# EAGLE design Beehive_sensor_PCB_Rev_2.0_Fixed (EAGLE 9.6.2)
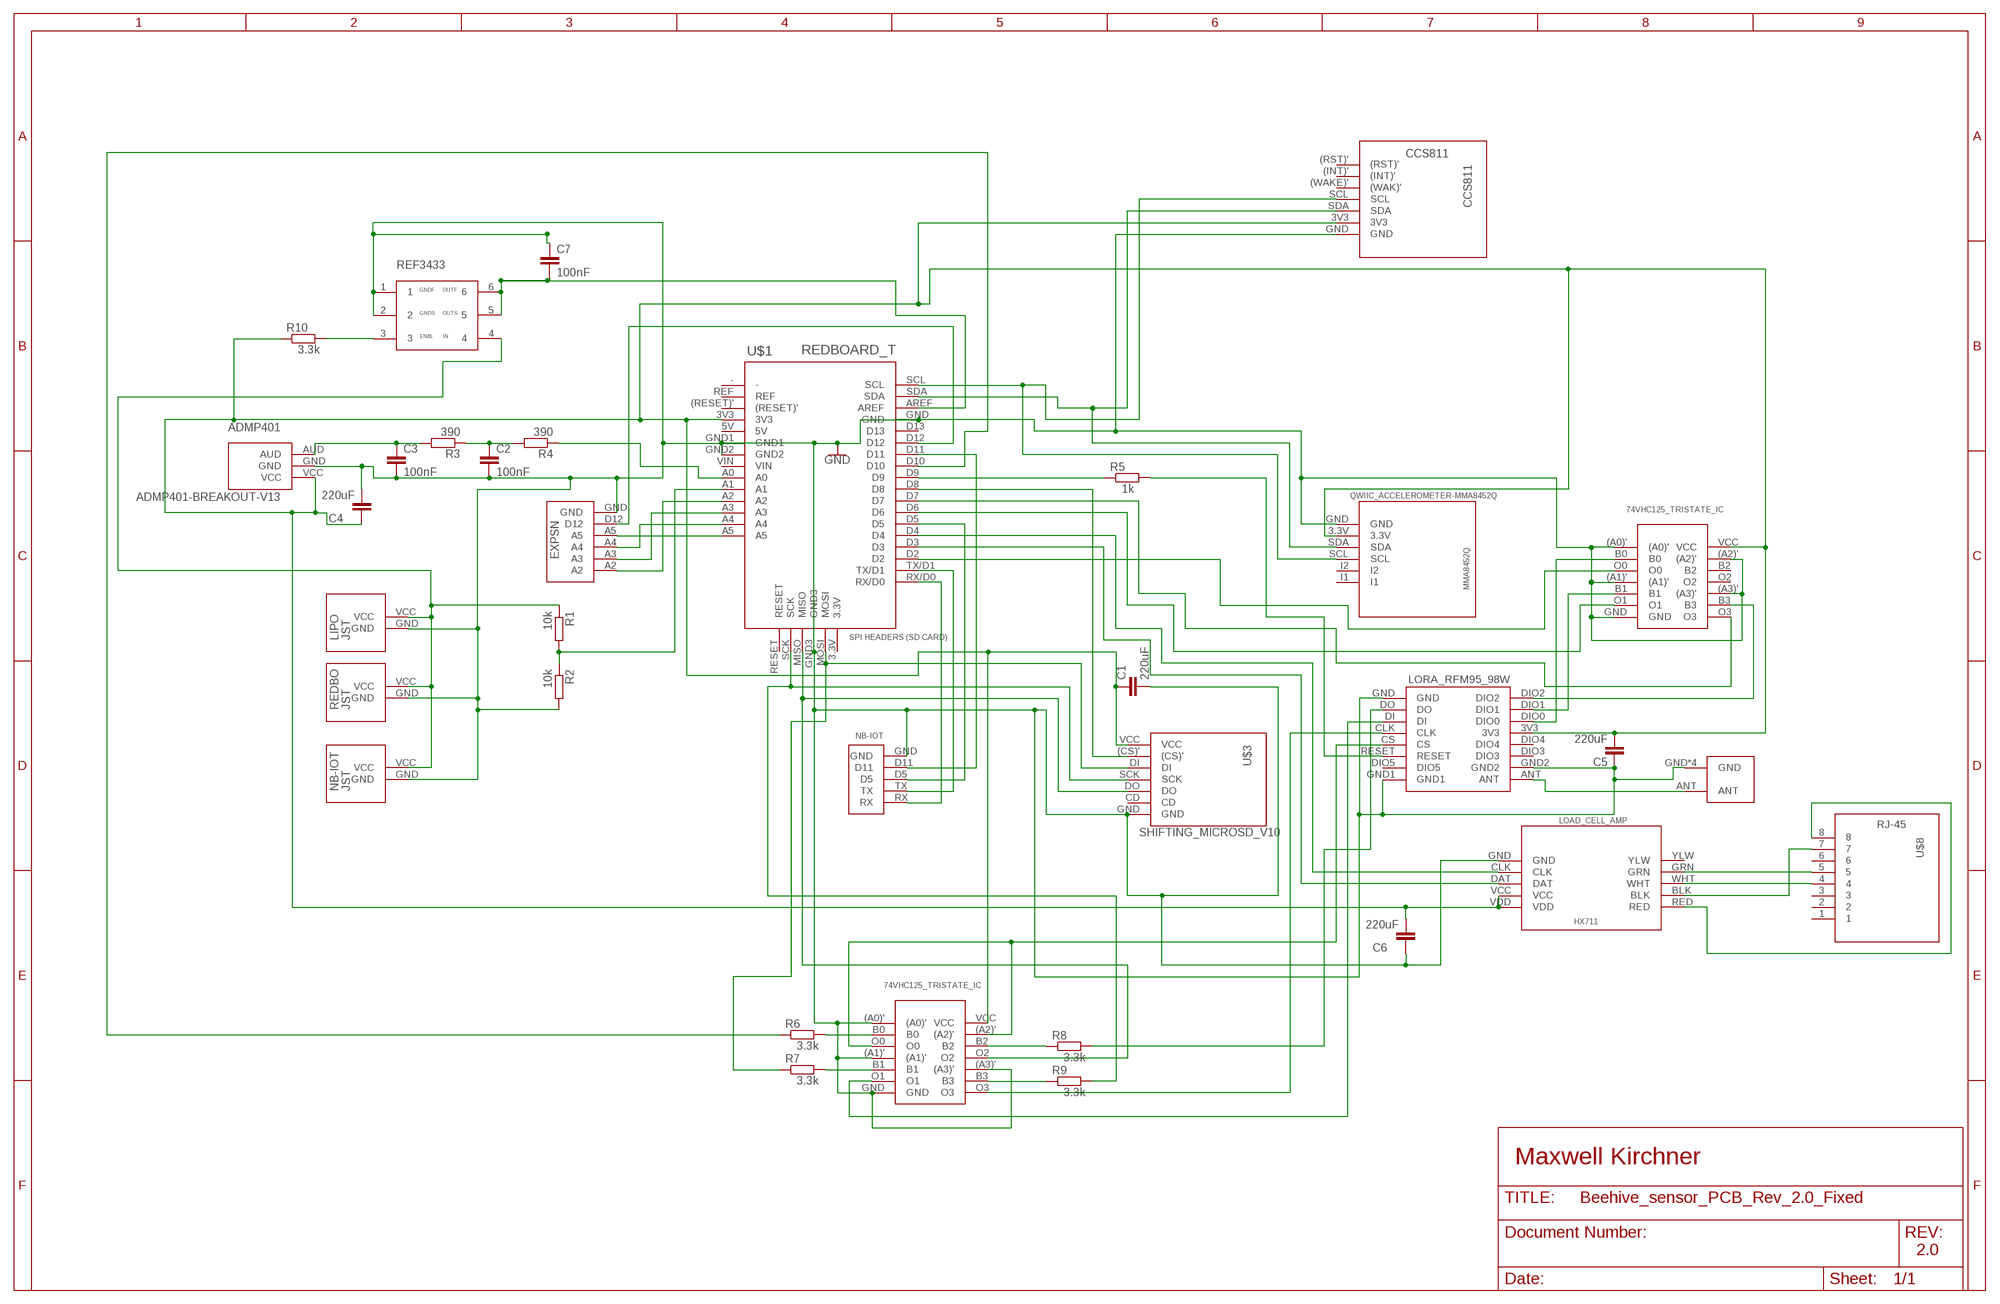
[diagram p0: schematic, sheet 1]

## Parts
ADMP401  ADMP401-BREAKOUT-V13  [ADMP401-BREAKOUT-V13]
C1  220uF  C-EU025-025X050  [C025-025X050]
C2  100nF  C-EU025-025X050  [C025-025X050]
C3  100nF  C-EU025-025X050  [C025-025X050]
C4  220uF  C-EU025-025X050  [C025-025X050]
C5  220uF  C-EU025-025X050  [C025-025X050]
C6  220uF  C-EU025-025X050  [C025-025X050]
C7  100nF  C-EU025-024X044  [C025-024X044]
CCS811  CCS811  [CCS811]
LIPO  JST  [JST]
LOAD_CELL_AMP  HX711  [HX711_LOAD_CELL_V11]
MMA8452Q  QWIIC_ACCELEROMETER-MMA8452Q  [QWIIC_ACCELEROMETER-MMA8452Q]
NB-IOT  JST  [JST]
R1  10k  R-EU_0204/7  [0204/7]
R2  10k  R-EU_0204/7  [0204/7]
R3  390  R-EU_0204/7  [0204/7]
R4  390  R-EU_0204/7  [0204/7]
R5  1k  R-EU_0204/7  [0204/7]
R6  3.3k  R-EU_0204/7  [0204/7]
R7  3.3k  R-EU_0204/7  [0204/7]
R8  3.3k  R-EU_0204/7  [0204/7]
R9  3.3k  R-EU_0204/7  [0204/7]
R10  3.3k  R-EU_0204/7  [0204/7]
REDBO  JST  [JST]
U$1  REDBOARD_T  [REDBOARD_T]
U$2  LORA_RFM95_98W  [RFM95_98W]
U$3  SHIFTING_MICROSD_V10  [SHIFTING_MICROSD_V10]
U$8  RJ-45  [RJ-45]
U$9  74VHC125_TRISTATE_IC  [74VHC125]
U$10  ANT  [ANT]
U$11  NB-IOT  [NB-IOT]
U$12  EXPSN  [EXPSN]
U$13  REF3433  [REF3433]
U$14  74VHC125_TRISTATE_IC  [74VHC125]

## Nets
GND: ADMP401.GND C1.2 C2.2 C3.2 C4.2 C5.1 C6.1 C7.1 CCS811.GND LIPO.GND LOAD_CELL_AMP.GND MMA8452Q.GND NB-IOT.GND R2.2 REDBO.GND U$1.GND U$1.GND1 U$1.GND2 U$1.GND3 U$2.GND U$2.GND1 U$2.GND2 U$3.GND U$9.(A0)' U$9.(A1)' U$9.(A3)' U$9.GND U$10.GND U$10.GND1(GND) U$10.GND2(GND) U$10.GND3(GND) U$11.GND U$12.GND U$13.1 U$13.2 U$14.(A0)' U$14.(A1)' U$14.(A2)' U$14.(A3)' U$14.GND
N$1: U$1.D8 U$3.(CS)'
N$4: R7.1 U$1.MOSI U$3.DI
N$5: R9.2 U$1.SCK U$3.SCK
N$6: U$1.MISO U$3.DO U$9.O2
N$7: CCS811.SCL MMA8452Q.SCL U$1.SCL
N$8: CCS811.SDA MMA8452Q.SDA U$1.SDA
N$9: C7.2 U$1.AREF U$13.5 U$13.6
N$10: ADMP401.AUD C3.1 R3.2
N$12: R6.2 U$9.B0
N$13: C2.1 R3.1 R4.2
N$14: R4.1 U$1.A0
N$15: U$2.DIO0 U$14.B0
N$16: LOAD_CELL_AMP.RED U$8.8
N$17: LOAD_CELL_AMP.BLK U$8.7
N$18: LOAD_CELL_AMP.GRN U$8.5
N$19: LOAD_CELL_AMP.WHT U$8.4
N$21: LOAD_CELL_AMP.DAT U$1.D3
N$22: LOAD_CELL_AMP.CLK U$1.D4
N$23: R5.2 U$2.RESET
N$24: U$2.DIO2 U$14.B3
N$25: U$2.DIO1 U$14.B1
N$26: R6.1 U$1.D10
N$28: LIPO.VCC NB-IOT.VCC R1.1 REDBO.VCC U$13.4
N$29: U$2.ANT U$10.ANT
N$30: R1.2 R2.1 U$1.A1
N$31: U$1.TX/D1 U$11.TX
N$32: U$1.RX/D0 U$11.RX
N$33: U$1.D5 U$11.D5
N$34: U$1.D11 U$11.D11
N$35: U$1.A2 U$12.A2
N$36: U$1.A3 U$12.A3
N$37: U$1.A4 U$12.A4
N$38: U$1.A5 U$12.A5
N$39: U$1.D12 U$12.D12
N$40: R5.1 U$1.D9
N$41: U$2.CS U$9.(A2)' U$9.O0
N$42: ADMP401.VCC C1.1 C4.1 C5.2 C6.2 CCS811.3V3 LOAD_CELL_AMP.VCC LOAD_CELL_AMP.VDD MMA8452Q.3.3V R10.1 U$1.3V3 U$2.3V3 U$3.VCC U$9.VCC U$14.VCC
N$43: R7.2 U$9.B1
N$44: U$2.DI U$9.O1
N$45: R8.1 U$9.B2
N$46: R8.2 U$2.DO
N$47: R9.1 U$9.B3
N$48: U$2.CLK U$9.O3
N$49: R10.2 U$13.3
N$50: U$1.D2 U$14.O0
N$51: U$1.D6 U$14.O1
N$52: U$1.D7 U$14.O3
Unconnected: CCS811.(INT)' CCS811.(RST)' CCS811.(WAKE)'((WAK)') LOAD_CELL_AMP.YLW MMA8452Q.I1 MMA8452Q.I2 U$1.3.3V U$1.5V U$1.(RESET)' U$1.- U$1.D13 U$1.REF U$1.RESET U$1.VIN U$2.DIO3 U$2.DIO4 U$2.DIO5 U$3.CD U$8.1 U$8.2 U$8.3 U$8.6 U$14.B2 U$14.O2

## Notes on the sheet
- Maxwell Kirchner
- 2.0

## Library data of the parts
ADMP401 = ADMP401:ADMP401-BREAKOUT-V13
C1-C7 = rcl:C-EU: CAPACITOR, European symbol; SPICEPREFIX: C
CCS811 = CCS811:CCS811
LIPO NB-IOT REDBO = JST:JST
LOAD_CELL_AMP = LOAD_CELL_AMP:HX711
MMA8452Q = Qwicc_acc_MMA:QWIIC_ACCELEROMETER-MMA8452Q
R1-R10 = rcl:R-EU_: RESISTOR, European symbol; SPICEPREFIX: R
U$1 = REDBOARD T:REDBOARD_T
U$2 = LORA RFM95_98W:LORA_RFM95_98W
U$3 = PCB project Shifting uSD:SHIFTING_MICROSD_V10
U$8 = RJ45 connector :RJ-45
U$9 U$14 = 74VHC125:74VHC125_TRISTATE_IC
U$10 = ANT:ANT
U$11 = NB-IOT:NB-IOT
U$12 = EXPSN:EXPSN
U$13 = REF3433:REF3433

## Board
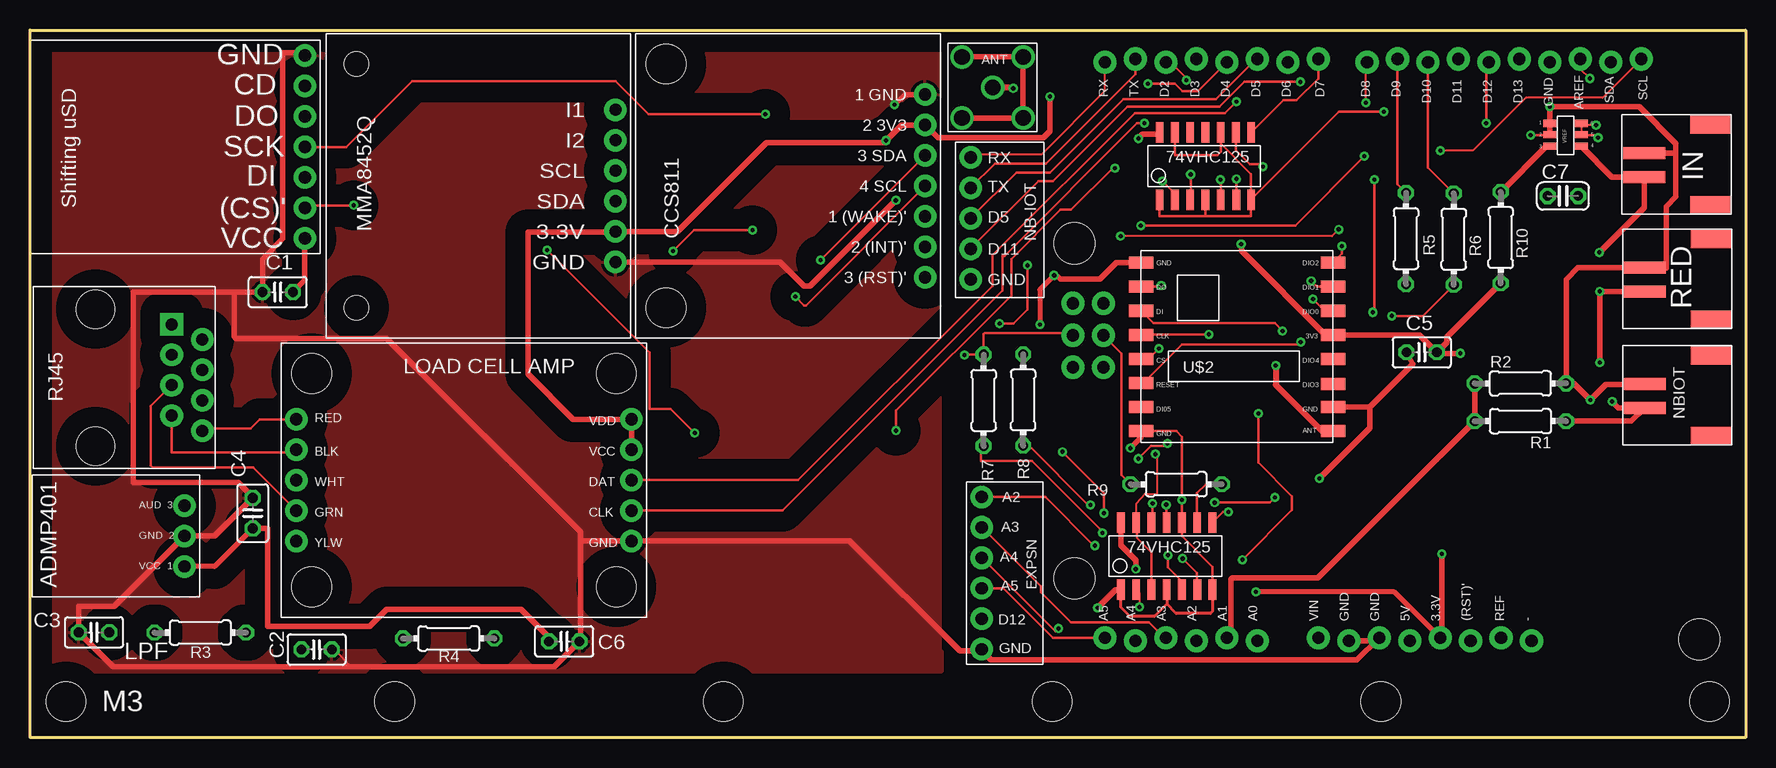
[diagram p1: board, top side]
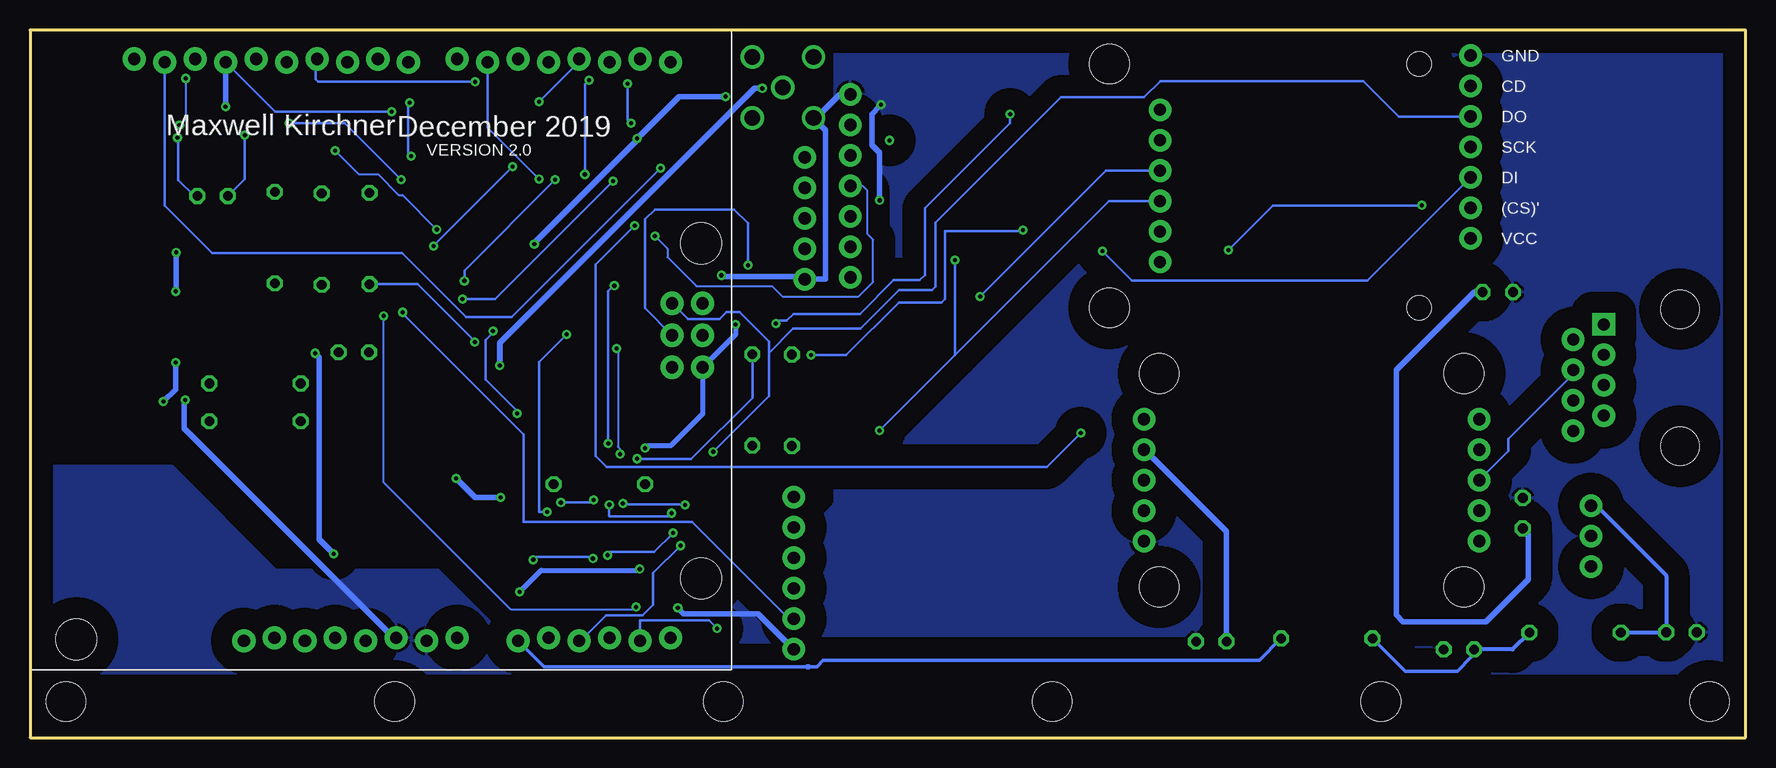
[diagram p2: board, bottom side, seen from below]

Size 143 x 59 mm. Coordinates in mm from the lower left corner, seen from the top.
Outline: 0,59 143,59 143,0 0,0 0,59
Copper layers (1*16): Top 0.035mm / dielectric 1.5mm / Bottom 0.035mm
Design rules "default *": minimum track width 6mil, minimum drill 0.35mm, track to track 8mil, track to pad 8mil, pad to pad 8mil, via to via 8mil, smd to smd 8mil, copper to edge 40mil, drill to drill 6mil, minimum pad ring 10mil, minimum via ring 8mil, stop-mask expansion 4mil, vias tented up to drill 0mil, thermal gap 10mil
Holes 3.3 mm at 3,3 140,3 30.4,3 57.8,3 85.2,3 112.6,3

### Footprints (pad centres in the part's own frame; a part is rotated, then mirrored left to right if it is on the bottom)
ADMP401-BREAKOUT-V13 = drill 1.016 pad 1.88: AUD 12.7,7.62; GND 12.7,5.08; VCC 12.7,2.54
C025-025X050 = drill 0.813 octagon: 1 -1.27,0; 2 1.27,0
C025-024X044 = drill 0.813 octagon: 1 -1.27,0; 2 1.27,0
CCS811 = drill 1.02 pad 1.88: 3V3 17.78,1.27; (INT)' 7.62,1.27; (RST)' 5.08,1.27; (WAKE)' 10.16,1.27; GND 20.32,1.27; SCL 12.7,1.27; SDA 15.24,1.27 | hole 3.3: 2.54,22.86; 22.86,22.86
JST = smd 1.5 x 3.4: FRONTPADS1 0.75,1.7; FRONTPADS2 7.45,1.7 | smd 1 x 3.5: GND 5.1,7.25; VCC 3.1,7.25
HX711_LOAD_CELL_V11 = drill 1.016 pad 1.88: BLK 1.27,13.97; CLK 29.21,8.89; DAT 29.21,11.43; GND 29.21,6.35; GRN 1.27,8.89; RED 1.27,16.51; VCC 29.21,13.97; VDD 29.21,16.51; WHT 1.27,11.43; YLW 1.27,6.35 | hole 3.302: 2.54,20.32; 27.94,20.32; 27.94,2.54; 2.54,2.54
QWIIC_ACCELEROMETER-MMA8452Q = drill 1.016 pad 1.88: 3.3V 8.89,1.27; GND 6.35,1.27; I1 19.05,1.27; I2 16.51,1.27; SCL 13.97,1.27; SDA 11.43,1.27 | hole 2.032: 2.54,22.86; 22.86,22.86
0204/7 = drill 0.813 octagon: 1 -3.81,0; 2 3.81,0
REDBOARD_T = drill 1.016 pad 1.93: 3.3V 56.02,30.556; 3V3 25.4,2.667; 5V 27.94,2.413; (RESET)' 22.86,2.413; - 17.78,2.413; A0 40.64,2.413; A1 43.18,2.667; A2 45.72,2.413; A3 48.26,2.667; A4 50.8,2.413; A5 53.34,2.667; AREF 13.716,50.927; D2 48.26,50.673; D3 45.72,50.927; D4 43.18,50.673; D5 40.64,50.927; D6 38.1,50.673; D7 35.56,50.927; D8 31.496,50.673; D9 28.956,50.927; D10 26.416,50.673; D11 23.876,50.927; D12 21.336,50.673; D13 18.796,50.927; GND 16.256,50.673; GND1 30.48,2.667; GND2 33.02,2.413; GND3 56.02,25.222; MISO 53.48,30.556; MOSI 56.02,27.889; REF 20.32,2.667; RESET 53.48,25.222; RX/D0 53.34,50.673; SCK 53.48,27.889; SCL 8.636,50.927; SDA 11.176,50.673; TX/D1 50.8,50.927; VIN 35.56,2.667 | hole 3.404: 3.81,2.54; 55.88,35.56; 55.88,7.62
RFM95_98W = smd 2.032 x 1.003: 3V3 16.002,8.966; ANT 16.002,0.94; CLK 0,8.966; CS 0,6.96; DI 0,10.973; DIO0 16.002,10.973; DIO1 16.002,12.979; DIO2 16.002,14.986; DIO3 16.002,4.877; DIO4 16.002,6.96; DIO5 0,2.946; DO 0,12.979; GND 0,14.999; GND1 0,0.94; GND2 16.002,2.946; RESET 0,4.953
SHIFTING_MICROSD_V10 = drill 1.016 pad 1.88: (CS)' 3.81,1.27; CD 13.97,1.27; DI 6.35,1.27; DO 11.43,1.27; GND 16.51,1.27; SCK 8.89,1.27; VCC 1.27,1.27
RJ-45 = drill 0.998 pad 1.88 square: 1 12.027,3.637 | drill 0.998 pad 1.88: 2 10.759,1.092; 3 9.487,3.637; 4 8.219,1.092; 5 6.947,3.637; 6 5.679,1.092; 7 4.407,3.637; 8 3.139,1.092 | hole 3.2: 1.864,9.985; 13.294,9.985
74VHC125 = smd 0.65 x 1.7: (A0)' 0,0; (A1)' 3.81,0; (A2)' 1.27,5.6; (A3)' 5.08,5.6; B0 1.27,0; B1 5.08,0; B2 2.54,5.6; B3 6.35,5.6; GND 7.62,0; O0 2.54,0; O1 6.38,0; O2 3.81,5.6; O3 7.62,5.6; VCC 0,5.6
ANT = drill 1.3 pad 1.956: ANT 3.696,3.696; GND 1.148,6.248; GND1 6.248,6.248; GND2 1.148,1.148; GND3 6.248,1.148
NB-IOT = drill 1.016 pad 1.88: D5 1.27,6.604; D11 1.27,4.064; GND 1.27,1.524; RX 1.27,11.684; TX 1.27,9.144
EXPSN = drill 1.016 pad 1.88: A2 1.27,13.97; A3 1.27,11.43; A4 1.27,8.89; A5 1.27,6.35; D12 1.27,3.81; GND 1.27,1.27
REF3433 = smd 1.1 x 0.6: 1 0,1.9; 2 0,0.95; 3 0,0; 4 2.6,0; 5 2.6,0.95; 6 2.6,1.9

### Placement (x,y rotation side)
ADMP401  0.18,11.72 0 top
C1  20.65,37.14 180 top
C2  23.89,7.34 0 top
C3  5.34,8.77 180 top
C4  18.57,18.71 90 top
C5  116.01,32.12 0 top
C6  44.53,8.01 180 top
C7  127.78,45.16 0 top
CCS811  75.88,33.3 90 top
LIPO  141.8,43.65 90 top
LOAD_CELL_AMP  20.93,10.03 0 top
MMA8452Q  50.07,33.3 90 top
NB-IOT  141.85,24.4 90 top
R1  124.24,26.38 180 top
R2  124.24,29.53 0 top
R3  14.2,8.75 180 top
R4  34.9,8.26 180 top
R5  114.7,41.61 270 top
R6  118.68,41.56 270 top
R7  79.49,28.12 270 top
R8  82.79,28.15 90 top
R9  95.54,21.12 180 top
R10  122.59,41.69 90 top
REDBO  141.85,34.1 90 top
U$1  142.95,5.65 0 bottom
U$2  92.61,24.61 0 top
U$3  24.18,40.36 90 top
U$8  15.45,22.43 90 top
U$9  90.94,12.32 0 top
U$10  76.54,50.51 0 top
U$11  77.14,36.69 0 top
U$12  78.07,6.09 0 top
U$13  126.7,49.31 0 top
U$14  94.17,44.85 0 top

### Tracks (layer width: path | path; a pad name or v marks a point on that pad's centre or on a via)
GND  (via drill 0.35)
  Top 0.152: 133.59,29.43 133.67,29.35 134.45,29.35 NB-IOT.GND | REDBO.GND | 128.68,29.53 R2.2
  Top 0.2: U$9.GND 98.56,14.24 96,16.8 96,17.9 U$9.(A3)' v96.02,19.81 96.02,25.08 95.55,25.55 U$2.GND1 | v103.77,20.02 103.34,19.59 v98.75,19.59 | U$13.2 126.67,50.23 126.63,50.23 v125.09,50.23 | C2.2 25.35,7.34 26.78,5.91 | U$14.GND 101.79,43.5 97.98,43.5 97.98,43.56 | 97.98,43.56 U$14.(A1)' | U$14.GND 101.79,46.97 99.25,49.51 U$14.(A3)' 99.25,48.85 98.97,48.57 95.45,48.57 95.43,48.59 U$14.(A2)' | U$14.GND 109.12,52.18 v112.86,52.18 | U$14.(A0)' 94.15,44.83 94.15,43.5 97.92,43.5 97.98,43.56
  Top 0.25: U$9.GND 98.56,10.51 98.4,10.35 95.54,10.35 94.75,11.14 | U$9.(A1)' 94.75,11.14 | 94.75,11.14 93.71,10.1 91.68,10.1 90.94,10.84 U$9.(A0)'
  Top 0.4: U$2.GND1 92.61,25.01 v91.73,24.13 | v85.37,38.54 84.18,37.35 v84.18,34.44
  Top 0.45: 45.88,16.38 LOAD_CELL_AMP.GND 68.33,16.38 77.5,7.21 79.47,7.21 79.47,7.23 U$12.GND 79.34,7.21 80.09,6.46 110.61,6.46 U$1.GND1 112.22,8.06 U$1.GND2 | 45.88,16.38 45.88,8.09 C6.1 43.69,5.9 26.79,5.9 26.78,5.91 6.93,5.91 C3.2 4.07,10.92 4.1,10.95 7.03,10.95 ADMP401.GND 15.39,16.8 C4.2 18.57,20.06 17.34,21.29 8.6,21.29 8.6,37.15 17,37.15 | U$3.GND 22.69,57.09 21.06,57.09 21.06,41.59 19.38,39.91 C1.2 18.75,37.14 18.74,37.15 17,37.15 | U$2.GND 90.56,39.61 89.17,38.22 85.9,38.22 85.58,38.54 v85.37,38.54 | v89,10.82 90.5,12.32 U$9.(A0)' | U$10.GND2 U$10.GND3 U$10.GND1 U$10.GND | 128.68,29.53 v130.06,28.15 131.34,29.43 133.59,29.43 | R2.2 128.05,38.2 129.04,39.19 REDBO.GND | 137.2,48.71 137.2,45.1 136.38,44.28 136.38,39.15 134.64,39.15 REDBO.GND | LIPO.GND 137.16,48.75 137.2,48.71 | MMA8452Q.GND 62.51,39.65 64.52,37.64 65.01,37.64 v72.17,44.8 | CCS811.GND 72.92,53.62 v72.06,52.76 | 126.63,50.23 126.7,50.3 U$13.1 v126.7,52.6 134.14,52.6 137.2,49.54 137.2,48.71 | C5.1 115.27,31.13 111.7,27.56 | U$2.GND2 111.7,27.56 | 111.7,27.56 111.7,25.83 v107.48,21.61 | REDBO.GND | 17,37.15 17,33.42 17.14,33.28 29.73,33.28 45.88,17.13 45.88,16.38
  Bottom 0.152: v130.06,28.15 130.16,28.15
  Bottom 0.2: 77.47,51.66 U$10.GND2 | v98.75,19.59 96.24,19.59 v96.02,19.81 | v112.86,52.18 122.55,52.18 126.52,56.15 | 72.17,52.65 v72.06,52.76 | C7.1 125.09,46.58 v125.09,50.23
  Bottom 0.4: v84.18,34.44 84.18,33.62 U$1.GND3 86.93,26.99 89.57,24.35 91.51,24.35 v91.73,24.13
  Bottom 0.45: U$10.GND2 76.67,50.64 76.67,38.22 U$11.GND 78.65,38.45 85.28,38.45 v85.37,38.54 | U$12.GND 82.31,10.33 88.51,10.33 v89,10.82 | U$1.GND1 112.7,8.32 130.16,25.78 130.16,28.15 | v72.17,44.8 72.17,48.76 72.82,49.41 72.82,52 72.17,52.65 | 126.52,56.15 U$1.GND v126.69,52.61 v126.7,52.6 | CCS811.GND 75.51,53.62 77.47,51.66 | v107.48,21.61 105.89,20.02 v103.77,20.02
  pour Top (isolate 1.676): 0.08,5.56 0.08,58.7 0.23,58.85 75.9,58.85 75.9,7.37 76.06,7.21 76.06,5.49 75.98,5.41 0.16,5.41
  pour Bottom (isolate 1.778): 0.27,5.76 0.27,58.85 0.14,58.98 75.57,58.98 75.98,58.57 75.98,19.48 81.47,13.99 122.48,13.99 131.12,22.63 142.78,22.63 143.05,22.36 143.05,5.76 142.64,5.35 0.68,5.35
N$1  (via drill 0.35)
  Top 0.152: v111.35,52.94 111.35,56.22 U$1.D8
  Top 0.2: v111.24,48.47 105.46,42.69 92.6,42.69 v92.59,42.68 | v55.41,25.39 53.39,27.41 51.64,27.41 51.64,32.11 v43.11,40.63 v43.11,40.64 | v26.98,44.38 v26.97,44.37 23.11,44.37 U$3.(CS)'
  Bottom 0.2: v111.35,52.94 111.46,52.83 111.46,48.69 v111.24,48.47 | v55.41,25.39 58.23,22.57 94.94,22.57 95.84,23.47 95.84,39.44 v92.6,42.68 v92.59,42.68 | v43.11,40.64 39.38,44.37 v26.99,44.37 v26.98,44.38
N$4  (via drill 0.35)
  Top 0.2: U$1.MOSI 86.73,33.74 79.6,33.74 79.49,33.63 R7.1 77.93,31.93 v77.89,31.89 | v60.22,42.31 55.34,42.31 v53.6,40.57
  Bottom 0.2: v77.89,31.89 74.96,31.89 70.56,36.29 67.01,36.29 66.73,36.57 66.73,42.24 60.29,42.24 v60.22,42.31 | v53.6,40.57 51.14,38.11 31.51,38.11 U$3.DI
N$5  (via drill 0.35)
  Top 0.2: U$1.SCK 90.97,32.04 90.97,21.88 R9.2 | v83.15,39.38 83.15,35.67 81.99,34.51 v80.83,34.51 | v61.3,51.99 51.55,51.99 48.8,54.74 31.85,54.74 26.36,49.25 U$3.SCK
  Bottom 0.2: U$1.SCK 91.73,35.8 91.73,43.21 90.91,44.03 84.3,44.03 83.15,42.88 v83.15,39.38 | v80.83,34.51 80.58,34.76 79.93,34.76 79.36,35.33 73.82,35.33 71.02,38.13 68.84,38.13 68.4,38.57 68.4,44.14 61.3,51.24 v61.3,51.99
N$6  (via drill 0.35)
  Top 0.2: v86.05,23.83 89.51,20.37 v89.51,18.71 | v94.71,19.41 94.71,17.96 U$9.O2
  Bottom 0.2: U$1.MISO 88.15,34.89 85.53,34.89 84.94,35.48 83.87,35.48 81.42,33.03 81.42,32.08 | 81.42,32.08 79.4,34.09 73.79,34.09 70.56,37.32 67.81,37.32 67.54,37.59 67.54,42.92 57.07,53.39 50.13,53.39 48.78,54.74 31.86,54.74 28.91,51.79 U$3.DO | 81.42,32.08 81.42,28.46 v86.05,23.83 | v89.51,18.71 89.77,18.45 94.69,18.45 94.71,18.47 v94.71,19.41
N$7  (via drill 0.35)
  Top 0.152: U$1.SCL 131.09,53.35 124.7,53.35 120.29,48.94 v117.57,48.94 | v109.09,42.37 108.53,41.81 v90.91,41.81
  Top 0.2: CCS811.SCL 74.61,45.97 64.68,36.04 64.54,36.04 v63.8,36.78
  Bottom 0.152: v117.57,48.94 115.59,46.96 114,46.96 112.27,45.23 111.94,45.23 111.94,45.22 v109.09,42.37 | v90.91,41.81 89.86,40.76 89.86,40.05 87.45,37.64 81.14,37.64 80.26,36.76 73.95,36.76 72.72,37.99 72.72,41.52 73.19,41.99 73.19,45.62 73.57,46 CCS811.SCL
  Bottom 0.2: MMA8452Q.SCL 53.31,47.27 v63.8,36.78
N$8  (via drill 0.35)
  Top 0.152: v90.44,47.49 90.25,47.49
  Top 0.2: CCS811.SDA 65.9,39.83 v65.9,39.81 | 90.25,47.49 86.76,44 85.9,44 81.81,39.91 81.81,36.87 72.19,27.25 v72.19,25.59
  Bottom 0.152: 65.9,31.9 65.89,31.89
  Bottom 0.2: v72.19,25.59 65.89,31.89 53.05,44.73 MMA8452Q.SDA | U$1.SDA 131.77,44.37 127.8,40.4 111.97,40.4 106.63,35.06 102.87,35.06 v90.44,47.49 | v65.9,39.81 65.9,31.9
N$9  (via drill 0.35)
  Top 0.152: U$13.6 129.3,51.11 | 129.3,51.11 U$13.5 | U$1.AREF 129.23,55.75 v130.02,54.96 | v130.54,51.06 129.35,51.06 129.3,51.11
  Top 0.2: U$13.5 129.35,50.21 130.63,50.21 130.71,50.13 v130.71,50.01
  Bottom 0.152: v130.02,54.96 130.02,51.58 v130.54,51.06
  Bottom 0.2: v130.71,50.01 130.69,50.01 130.63,49.95 130.63,46.5 129.29,45.16 C7.2
N$10
  Bottom 0.35: ADMP401.AUD 12.42,19.34 6.61,13.53 C3.1 10.37,8.77 R3.2
N$12  (via drill 0.35)
  Top 0.152: U$9.B0 92.49,12.04 v92.49,10.88
  Top 0.2: R6.2 116.09,35.16 v113.53,35.16
  Bottom 0.152: v92.49,10.88 92.7,10.67 102.92,10.67 113.53,21.28 v113.53,35.16
N$13
  Bottom 0.2: 22.84,7.28 22.89,7.33 | C2.1
  Bottom 0.3: R4.2 28.35,5.52 24.03,5.52 22.84,6.71 22.84,7.28
  Bottom 0.35: R3.1 19.43,7.33 C2.1 22.89,7.33
N$14
  Bottom 0.3: R4.1 40.53,6.44 76.88,6.44 77.42,5.91 78.1,5.91 | U$1.A0 100.16,5.91 78.2,5.91
  Bottom 0.45: 78.1,5.91 78.2,5.91
N$15  (via drill 0.35)
  Top 0.2: v106.95,36.56 107.93,35.58 U$2.DIO0 | v94.41,46.4 95.44,45.37 U$14.B0
  Bottom 0.2: v94.41,46.4 104.25,36.56 v106.95,36.56
N$16
  Top 0.2: U$8.8 14.57,25.78 18.41,25.78 19.14,26.51 21.99,26.51 22.02,26.54 LOAD_CELL_AMP.RED
N$17
  Top 0.2: U$8.7 11.81,23.77 21.97,23.77 LOAD_CELL_AMP.BLK
N$18
  Top 0.2: LOAD_CELL_AMP.GRN 18.59,22.53 10.22,22.53 10.08,22.67 10.08,27.64 U$8.5
N$19
  Bottom 0.2: U$8.4 14.36,30.3 19.76,24.9 19.76,23.9 LOAD_CELL_AMP.WHT
N$21  (via drill 0.35)
  Top 0.2: LOAD_CELL_AMP.DAT 64.04,21.46 80.24,37.66 80.24,40.21 92.09,52.06 99.6,52.06 v100.57,53.03
  Bottom 0.2: v100.57,53.03 97.23,56.37 U$1.D3
N$22  (via drill 0.35)
  Top 0.2: v93.18,54.53 95.43,54.53 96.05,53.91 97.36,53.91 U$1.D4 | LOAD_CELL_AMP.CLK 62.71,18.92 81.08,37.29 81.08,40.16 81.22,40.16 92.27,51.21 v92.88,51.21 v92.89,51.22
  Bottom 0.2: v92.89,51.22 93.18,51.51 v93.18,54.53
N$23  (via drill 0.35)
  Top 0.2: v105.92,32.99 105.71,32.78 96.04,32.78 92.82,29.56 U$2.RESET
  Bottom 0.2: v105.92,32.99 105.92,33.05 110.67,37.8 R5.2
N$24  (via drill 0.35)
  Top 0.2: U$14.B3 100.52,48.98 101.69,47.81 102.56,47.81 v102.76,47.61 | v109.36,40.98 109.36,40.34 U$2.DIO2
  Bottom 0.2: v102.76,47.61 109.36,41.01 v109.36,40.98
N$25  (via drill 0.35)
  Top 0.2: U$14.B1 99.25,46.49 v99.23,46.51 | v106.79,38.08 107.28,37.59 U$2.DIO1
  Bottom 0.2: v99.23,46.51 106.79,38.95 v106.79,38.08
N$26
  Top 0.2: U$1.D10 116.53,47.52 R6.1
N$28  (via drill 0.35)
  Top 0.45: v130.82,40.45 134.55,44.18 LIPO.VCC 131.86,46.75 U$13.4 | REDBO.VCC v130.85,37.2 v130.85,31.29 v130.86,31.28 | v131.88,28.01 132.39,27.5 NB-IOT.VCC 133.48,26.38 R1.1
  Bottom 0.45: v130.82,40.45 130.82,37.23 v130.85,37.2 | v130.86,31.28 130.86,29.03 v131.88,28.01
N$29  (via drill 0.35)
  Top 0.2: v81.96,54.13 81.88,54.21
  Top 0.5: 81.88,54.21 U$10.ANT | v103.84,31.02 103.84,29.4 107.69,25.55 U$2.ANT
  Bottom 0.45: 82.59,54.13 v81.96,54.13
  Bottom 0.5: 82.59,54.13 103.84,32.88 v103.84,31.02
N$30
  Top 0.45: R2.1 R1.2 107.36,13.31 100.21,13.31 100.1,13.2 100.1,8.65 U$1.A1
N$31
  Top 0.2: U$11.TX 80.42,47.84 84.68,47.84 92.15,55.32 U$1.TX/D1
N$32
  Top 0.152: U$11.RX 78.65,48.61 84.29,48.61 89.61,53.93 U$1.RX/D0
N$33
  Top 0.2: U$11.D5 82.24,47.12 85.01,47.12 91.13,53.24 98.85,53.24 102.19,56.58 U$1.D5
N$34  (via drill 0.35)
  Top 0.2: U$11.D11 84.06,46.4 85.26,46.4 91.47,52.61 99.13,52.61 101.22,54.7 105.9,54.7 v105.9,54.67
  Bottom 0.2: v105.9,54.67 118.97,54.67 119.19,54.89 119.19,56.46 U$1.D11
N$35  (via drill 0.35)
  Top 0.2: U$12.A2 84.63,20.06 88.69,16 v88.77,16
  Bottom 0.2: v88.77,16 91.06,13.71 91.06,11.07 91.94,10.19 94.97,10.19 97.1,8.06 U$1.A2
N$36
  Top 0.2: U$12.A3 84.25,12.61 84.25,12.1 86.76,9.6 93.28,9.6 94.56,8.32 U$1.A3
N$37  (via drill 0.35)
  Top 0.2: U$12.A4 85.48,8.85 v85.72,9.09
  Bottom 0.2: U$1.A4 92.15,9.76 86.39,9.76 v85.72,9.09
N$38
  Top 0.2: U$12.A5 81.16,12.44 85.28,8.32 U$1.A5
N$39  (via drill 0.35)
  Top 0.2: v111.93,35.46 112.06,35.59 v112.06,46.52 v112.07,46.53 | v121.38,51.22 121.38,56.09 U$1.D12
  Bottom 0.2: U$12.D12 79.72,9.9 87.79,17.98 101.84,17.98 101.84,25.26 111.93,35.35 v111.93,35.46 | v112.07,46.53 116.76,51.22 v121.38,51.22
N$40
  Top 0.2: U$1.D9 113.99,46.13 R5.1
N$41  (via drill 0.35)
  Top 0.152: 92.27,16.92 92.27,16.66 93.48,15.45 | U$9.(A2)' 92.21,19.51 92.94,20.32 93.96,20.32 93.96,23.44 93.81,23.59 v93.81,23.63 | v94.1,32.43 93.24,31.57 U$2.CS
  Top 0.2: 93.48,15.45 U$9.O0 | 92.27,16.92 92.27,17.86 U$9.(A2)'
  Bottom 0.152: v93.81,23.63 93.81,24.05 94,24.24 94,32.33 v94.1,32.43
N$42  (via drill 0.35)
  Top 0.152: 71.3,49.61 v71.36,49.79
  Top 0.4: U$1.3V3 113.72,12.14 v102.19,12.14 | C4.1 15.39,14.26 ADMP401.VCC
  Top 0.45: C5.2 118.09,32.94 118.09,33.38 R10.1 | C5.2 117.36,32.04 v119.24,32.04 | v117.68,15.31 117.68,8.45 U$1.3V3 | v100.96,41.14 100.96,40.6 108.1,33.46 108.49,33.46 U$2.3V3 115.82,33.58 C5.2 | v92.39,49.95 92.37,49.95 92.72,50.3 94.02,50.3 U$14.VCC | LOAD_CELL_AMP.VCC LOAD_CELL_AMP.VDD 45.29,26.54 41.5,30.33 41.5,42.16 48.77,42.16 MMA8452Q.3.3V 53.96,42.19 61.38,49.61 71.3,49.61 | v71.36,49.79 72.65,51.08 CCS811.3V3 75.68,50.01 84.48,50.01 85.03,50.56 v85.03,53.45 | U$3.VCC 22.91,38.13 C1.1 | C4.1 19.82,17.44 19.82,9.26 28.31,9.26 29.72,10.67 40.95,10.67 43.26,8.36 C6.2 | U$9.VCC 90.93,16.03 92.2,14.76 92.2,14.08 v92.17,14.05
  Bottom 0.4: v102.19,12.14 100.39,13.94 92.17,13.94 v92.17,14.05
  Bottom 0.45: v119.24,32.04 118.9,31.7 118.9,16.53 v117.68,15.31 | v100.96,41.14 100.96,41.23 92.39,49.8 v92.39,49.95 88.89,53.45 v85.03,53.45 | LOAD_CELL_AMP.VCC 50.08,24 43.26,17.18 C6.2 | C4.1 18.12,16.99 18.12,13.19 21.65,9.66 28.55,9.66 29.12,10.23 29.12,30.63 22.61,37.14 C1.1
N$43  (via drill 0.35)
  Top 0.2: U$9.B1 96.12,12.42 96.12,12.93 94.86,14.19 v94.86,15.2 | v89.39,17.07 89.39,17.18 83.52,23.05 79.26,23.05 79.26,24.08 R7.2
  Bottom 0.2: v94.86,15.2 94.6,15.46 90.96,15.46 89.36,17.07 v89.39,17.07
N$44  (via drill 0.35)
  Top 0.2: U$2.DI 93.64,34.55 103.75,34.55 v104.41,33.89 | v102.39,27.01 102.39,22.92 105.2,20.11 105.2,18.98 v101.05,14.83 | v96.08,14.92 97.29,13.71 97.29,12.35 U$9.O1
  Bottom 0.2: v104.41,33.89 104.41,33.77 105.02,33.16 105.02,29.84 102.39,27.21 v102.39,27.01 | v96.08,14.92 96.21,15.05 100.83,15.05 v101.05,14.83
N$45  (via drill 0.35)
  Top 0.2: R8.1 83.26,24.34 88.19,19.41 v88.39,19.41 | v93.58,19.51 93.58,18.02 U$9.B2
  Bottom 0.2: v88.39,19.41 88.37,19.43 93.5,19.43 v93.58,19.51
N$46  (via drill 0.35)
  Top 0.2: v94.29,37.67 94.21,37.59 U$2.DO | v94.8,24.52 94.59,24.31 93.45,24.31 v92.39,23.25
  Bottom 0.2: v94.8,24.52 v94.81,24.53 94.81,37.23 94.33,37.71 v94.29,37.67 | v92.39,23.25 92.36,23.25 92.32,23.21 87.88,23.21 82.79,28.3 R8.2
N$47
  Top 0.2: U$9.B3 97.29,20.4 98.01,21.12 R9.1
N$48  (via drill 0.35)
  Top 0.2: U$9.O3 99.45,18.81 v99.88,18.81 v99.89,18.82 | v98.26,33.62 98.24,33.6 92.83,33.6 92.81,33.58 U$2.CLK
  Bottom 0.2: v99.89,18.82 100.58,18.82 100.58,31.3 v98.26,33.62
N$49
  Top 0.45: R10.2 126.4,49.31 U$13.3
N$50  (via drill 0.35)
  Top 0.2: U$1.D2 95.06,56.32 96.4,54.98 v96.4,54.82 | v96.75,46.96 96.75,44.89 U$14.O0
  Bottom 0.2: v96.4,54.82 96.75,54.47 v96.75,46.96
N$51  (via drill 0.35)
  Top 0.2: U$14.O1 100.55,46.53 100.56,46.54 v100.56,46.58
  Bottom 0.2: v100.56,46.58 104.85,50.87 U$1.D6
N$52
  Top 0.2: U$14.O3 104.47,53.13 105.58,53.13 107.39,54.94 U$1.D7

### Text on the board
tPlace: GND | CD | DO | SCK | DI | (CS)' | VCC | NBIOT | ADMP401 | LPF | M3
bPlace: December 2019 | Maxwell Kirchner | VERSION 2.0
tNames: IN | RED